# Altium project RS2-708_V010.PrjPCB (part 5 of 6)
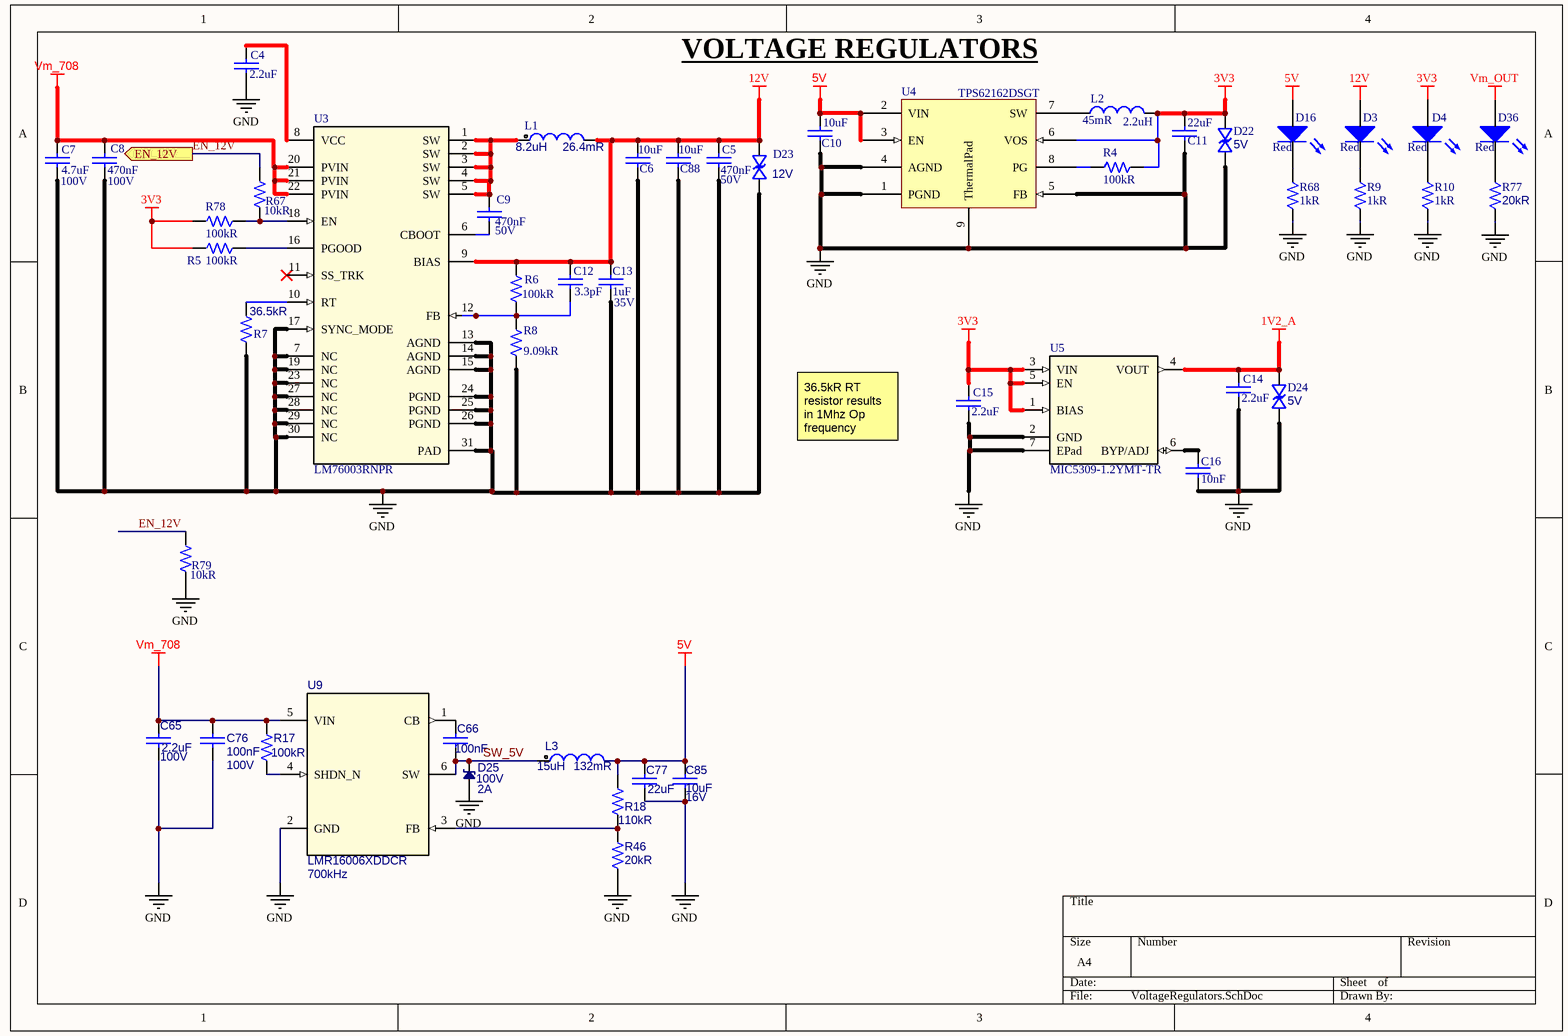
[diagram p11: VoltageRegulators.SchDoc]

## Sheet VoltageRegulators.SchDoc (continued)

### Library data of the parts (continued)
R67 R79 = Resistor: as R19 on sheet KSZ8795CLX; Supplier 1: Digi-Key; Supplier Part Number 1: P10.0KLDKR-ND; Stock 1: 3290329; Pricing 1: 1=0,10000, 10=0,04100, 100=0,01680, 1000=0,00753, 2500=0,00653, 5000=0,00540 (USD); RoHS: Yes; Mount: Surface Mount; Case/Package: 0402; Number of Pins: 2; Contact Plating: Tin; Case Code (Metric): 1005; Case Code (Imperial): 0402; Min Operating Temperature: -55°C; Max Operating Temperature: 155°C; Packaging: Tape and Reel; Package Quantity: 1; Voltage Rating (DC): 50V; Features: Automotive AEC-Q200; Max Power Dissipation: 100mW; Composition: Thick Film; Number of Terminations: 2; Termination: SMD/SMT; Military Standard: Not; Length: 1mm; Height: 0.35mm; Width: 0.02inch; Depth: 0.5mm; Radiation Hardening: No; Lead Free: Lead Free; REACH SVHC: No SVHC; ComponentLink1URL: https://datasheet.ciiva.com/11821/0900766b80f80784-11821171.pdf?src-supplier=RSComponents; ComponentLink1Description: https://datasheet.ciiva.com/11821/0900766b80f80784-11821171.pdf?src-supplier=RSComponents; ComponentLink2URL: https://datasheet.ciiva.com/16199/aoa0000ce2-16199478.pdf?src-supplier=Future+Electronics; ComponentLink2Description: https://datasheet.ciiva.com/16199/aoa0000ce2-16199478.pdf?src-supplier=Future+Electronics; ComponentLink3URL: https://datasheet.ciiva.com/17212/aoa0000ce2-17212102.pdf?src-supplier=Avnet+Europe; ComponentLink3Description: https://datasheet.ciiva.com/17212/aoa0000ce2-17212102.pdf?src-supplier=Avnet+Europe; ComponentLink4URL: https://datasheet.ciiva.com/24023/aoa0000ce2-24023017.pdf?src-supplier=Mouser; ComponentLink4Description: https://datasheet.ciiva.com/24023/aoa0000ce2-24023017.pdf?src-supplier=Mouser; ComponentLink5URL: https://datasheet.ciiva.com/28514/1678782-28514185.pdf?src-supplier=Element14; ComponentLink5Description: https://datasheet.ciiva.com/28514/1678782-28514185.pdf?src-supplier=Element14; ComponentLink6URL: https://datasheet.ciiva.com/43467/1678782-43467402.pdf?src-supplier=Farnell; ComponentLink6Description: https://datasheet.ciiva.com/43467/1678782-43467402.pdf?src-supplier=Farnell; ComponentLink7URL: https://datasheet.ciiva.com/27055/1987020-27055643.pdf?src-supplier=Jameco; ComponentLink7Description: https://datasheet.ciiva.com/27055/1987020-27055643.pdf?src-supplier=Jameco; ComponentLink8URL: https://datasheet.ciiva.com/48531/aoa0000ce2-48531069.pdf?src-supplier=Avnet; ComponentLink8Description: https://datasheet.ciiva.com/48531/aoa0000ce2-48531069.pdf?src-supplier=Avnet; ComponentLink9URL: https://datasheet.ciiva.com/9194/aoa0000ce2-9194142.pdf?src-supplier=Avnet; ComponentLink9Description: https://datasheet.ciiva.com/9194/aoa0000ce2-9194142.pdf?src-supplier=Avnet; ComponentLink10URL: https://datasheet.ciiva.com/16782/70260748-16782590.pdf?src-supplier=Allied+Electronics; ComponentLink10Description: https://datasheet.ciiva.com/16782/70260748-16782590.pdf?src-supplier=Allied+Electronics; ComponentLink11URL: https://datasheet.ciiva.com/16786/70260748-16786734.pdf?src-supplier=Allied+Electronics; ComponentLink11Description: https://datasheet.ciiva.com/16786/70260748-16786734.pdf?src-supplier=Allied+Electronics; ComponentLink12URL: https://datasheet.ciiva.com/30201/aoa0000ce2-30201022.pdf?src-supplier=Onlinecomponents.com; ComponentLink12Description: https://datasheet.ciiva.com/30201/aoa0000ce2-30201022.pdf?src-supplier=Onlinecomponents.com
R77 = Resistor: RES SMD 20K OHM 5% 1/4W 0603; Manufacturer 1: Panasonic; Manufacturer Part Number 1: ERJ-PA3J203V; Max Power Dissipation: 250mW; Temperature Coefficient: 200ppm/°C; Supplier 1: Digi-Key; Supplier Part Number 1: P20KBZCT-ND; RoHS: Yes; Category: Chip SMD Resistors; Stock 1: 22079; Pricing 1: 1=0,10000, 10=0,08600, 100=0,03300, 1000=0,01452, 2500=0,01254 (USD); Case/Package: 0603; Case Code (Imperial): 0603; Case Code (Metric): 1608; Min Operating Temperature: -55°C; Max Operating Temperature: 155°C; Tolerance: 5%; Packaging: Tape and Reel; Resistor Type: Thick Film; Number of Terminations: 2; Features: Automotive AEC-Q200; Length: 0.063inch; Width: 0.031inch; Height: 0.018inch; ComponentLink1URL: https://industrial.panasonic.com/cdbs/www-data/pdf/RDO0000/AOA0000C331.pdf?src-supplier=Digi-Key; ComponentLink1Description: https://industrial.panasonic.com/cdbs/www-data/pdf/RDO0000/AOA0000C331.pdf?src-supplier=Digi-Key
U3 = LM76003RNPR: Buck Switching Regulator IC Positive Adjustable 1V 1 Output 3.5A 30-WFQFN Exposed Pad; Manufacturer 1: Texas Instruments; Number of Outputs: 1; Min Input Voltage: 3.5V; Max Input Voltage: 60V; Max Output Voltage: 57V; Switching Frequency: 2.2MHz; Synchronous Rectifier: Yes; Supplier 1: Digi-Key; Manufacturer Part Number 1: LM76003RNPR; Stock 1: 8327; Pricing 1: 1=6,06000, 10=5,44500, 25=5,14800, 100=4,23280, 250=3,79808, 500=3,66080, 1000=3,04304 (USD); RoHS: No; Mount: Surface Mount; Min Operating Temperature: -40°C; Max Operating Temperature: 125°C; Output Type: Adjustable; Packaging: Tape and Reel; Output Configuration: Positive; Min Output Voltage: 1V; Output Current: 3.5A; ComponentLink1URL: http://www.ti.com/lit/ds/symlink/lm76003.pdf?src-supplier=Digi-Key; ComponentLink1Description: http://www.ti.com/lit/ds/symlink/lm76003.pdf?src-supplier=Digi-Key; Supplier Part Number 1: 296-49740-1-ND
U4 = TPS6216X: Manufacturer 1: Texas Instruments; Min Output Voltage: 3.3V; Synchronous Rectifier: Yes; Max Output Current: 1A; Max Input Voltage: 17V; Min Input Voltage: 3V; Output Type: Fixed; Output Configuration: Positive; Quiescent Current: 17uA; Switching Frequency: 2.25MHz; Number of Outputs: 1; Supplier 1: Digi-Key; Supplier Part Number 1: 296-29897-1-ND; Stock 1: 23948; Pricing 1: 1=1,63000, 10=1,46000, 25=1,38600, 100=1,06430 (USD); RoHS: Yes; Case/Package: SOIC; Number of Pins: 8; Contact Plating: Gold; Min Operating Temperature: -40°C; Max Operating Temperature: 125°C; Max Output Voltage: 3.3V; Output Voltage: 3.3V; Output Current: 1A; Packaging: Tape and Reel; Package Quantity: 1; Nominal Output Voltage: 3.3V; Operating Supply Voltage: 17V; Length: 2.1mm; Height: 0.75mm; Width: 2.1mm; Radiation Hardening: No; REACH SVHC: No SVHC; Lead Free: Lead Free; ComponentLink1URL: https://datasheet.ciiva.com/2026/tps62160-2026052.pdf?src-supplier=Digi-Key; ComponentLink1Description: https://datasheet.ciiva.com/2026/tps62160-2026052.pdf?src-supplier=Digi-Key; ComponentLink2URL: https://datasheet.ciiva.com/2026/tps62160-2026053.pdf?src-supplier=Digi-Key; ComponentLink2Description: https://datasheet.ciiva.com/2026/tps62160-2026053.pdf?src-supplier=Digi-Key; ComponentLink3URL: https://datasheet.ciiva.com/2026/tps62160-2026054.pdf?src-supplier=Digi-Key; ComponentLink3Description: https://datasheet.ciiva.com/2026/tps62160-2026054.pdf?src-supplier=Digi-Key; ComponentLink4URL: https://datasheet.ciiva.com/46425/1857528-46425721.pdf?src-supplier=Element14; ComponentLink4Description: https://datasheet.ciiva.com/46425/1857528-46425721.pdf?src-supplier=Element14; ComponentLink5URL: https://datasheet.ciiva.com/46425/1857528-46425722.pdf?src-supplier=Element14; ComponentLink5Description: https://datasheet.ciiva.com/46425/1857528-46425722.pdf?src-supplier=Element14; ComponentLink6URL: https://datasheet.ciiva.com/46425/1857528-46425743.pdf?src-supplier=Element14; ComponentLink6Description: https://datasheet.ciiva.com/46425/1857528-46425743.pdf?src-supplier=Element14
U5 = MIC5309-xx: Linear Voltage Regulator; Manufacturer 1: Microchip; Supplier 1: Digi-Key; Supplier Part Number 1: 576-3050-1-ND; Stock 1: 5043; Pricing 1: 1=0,81000, 25=0,67000, 100=0,61000 (USD); RoHS: Yes; ComponentLink1URL: https://datasheet.ciiva.com/46425/1833743-46425628.pdf?src-supplier=Element14; ComponentLink1Description: https://datasheet.ciiva.com/46425/1833743-46425628.pdf?src-supplier=Element14
U9 = LMR16006: SIMPLE SWITCHER® 4V to 60V, 600mA Step-Down Regulator with Low Iq 6-SOT-23-THIN -40 to 125; Manufacturer 1: Texas Instruments; Number of Outputs: 1; Output Voltage: 55V; Min Output Voltage: 765mV; Synchronous Rectifier: No; Quiescent Current: 28uA; Output Type: Adjustable; Output Configuration: Positive; Supplier 1: Digi-Key; Supplier Part Number 1: 296-40293-1-ND; RoHS: Yes; Category: Power Supply Modules; Pricing 1: 1=3,26000, 10=2,93100, 25=2,77120, 100=2,40190, 250=2,27868, 500=2,04466, 1000=2,03350 (USD); Mount: Surface Mount; Case/Package: SOT-23-6; Number of Pins: 6; Contact Plating: Gold; Min Operating Temperature: -40°C; Max Operating Temperature: 125°C; Max Output Current: 600mA; Min Input Voltage: 4V; Max Input Voltage: 60V; Packaging: Tape and Reel; Max Output Voltage: 55V; Output Current: 600mA; Operating Supply Voltage: 60V; REACH SVHC: No SVHC; Lead Free: Lead Free; RoHS Compliant: Yes; ComponentLink1URL: http://www.ti.com/general/docs/lit/getliterature.tsp?genericPartNumber=LMR16006&&fileType=pdf&src-supplier=Avnet; ComponentLink1Description: http://www.ti.com/general/docs/lit/getliterature.tsp?genericPartNumber=LMR16006&&fileType=pdf&src-supplier=Avnet; ComponentLink2URL: http://www.ti.com/lit/ds/symlink/lmr16006.pdf?src-supplier=Digi-Key; ComponentLink2Description: http://www.ti.com/lit/ds/symlink/lmr16006.pdf?src-supplier=Digi-Key; ComponentLink3URL: http://www.ti.com/general/docs/lit/getliterature.tsp?genericPartNumber=LMR16006&amp;&amp;fileType=pdf&src-supplier=Farnell; ComponentLink3Description: http://www.ti.com/general/docs/lit/getliterature.tsp?genericPartNumber=LMR16006&amp;&amp;fileType=pdf&src-supplier=Farnell; ComponentLink4URL: http://www.ti.com/general/docs/lit/getliterature.tsp?genericPartNumber=LMR16006&&fileType=pdf&src-supplier=Element14; ComponentLink4Description: http://www.ti.com/general/docs/lit/getliterature.tsp?genericPartNumber=LMR16006&&fileType=pdf&src-supplier=Element14; ComponentLink5URL: http://www.ti.com/general/docs/lit/getliterature.tsp?genericPartNumber=LMR16006&amp;&amp;fileType=pdf&src-supplier=Avnet+Asia; ComponentLink5Description: http://www.ti.com/general/docs/lit/getliterature.tsp?genericPartNumber=LMR16006&amp;&amp;fileType=pdf&src-supplier=Avnet+Asia

## Sheet W5500_ETH-SPI.SchDoc
size A4
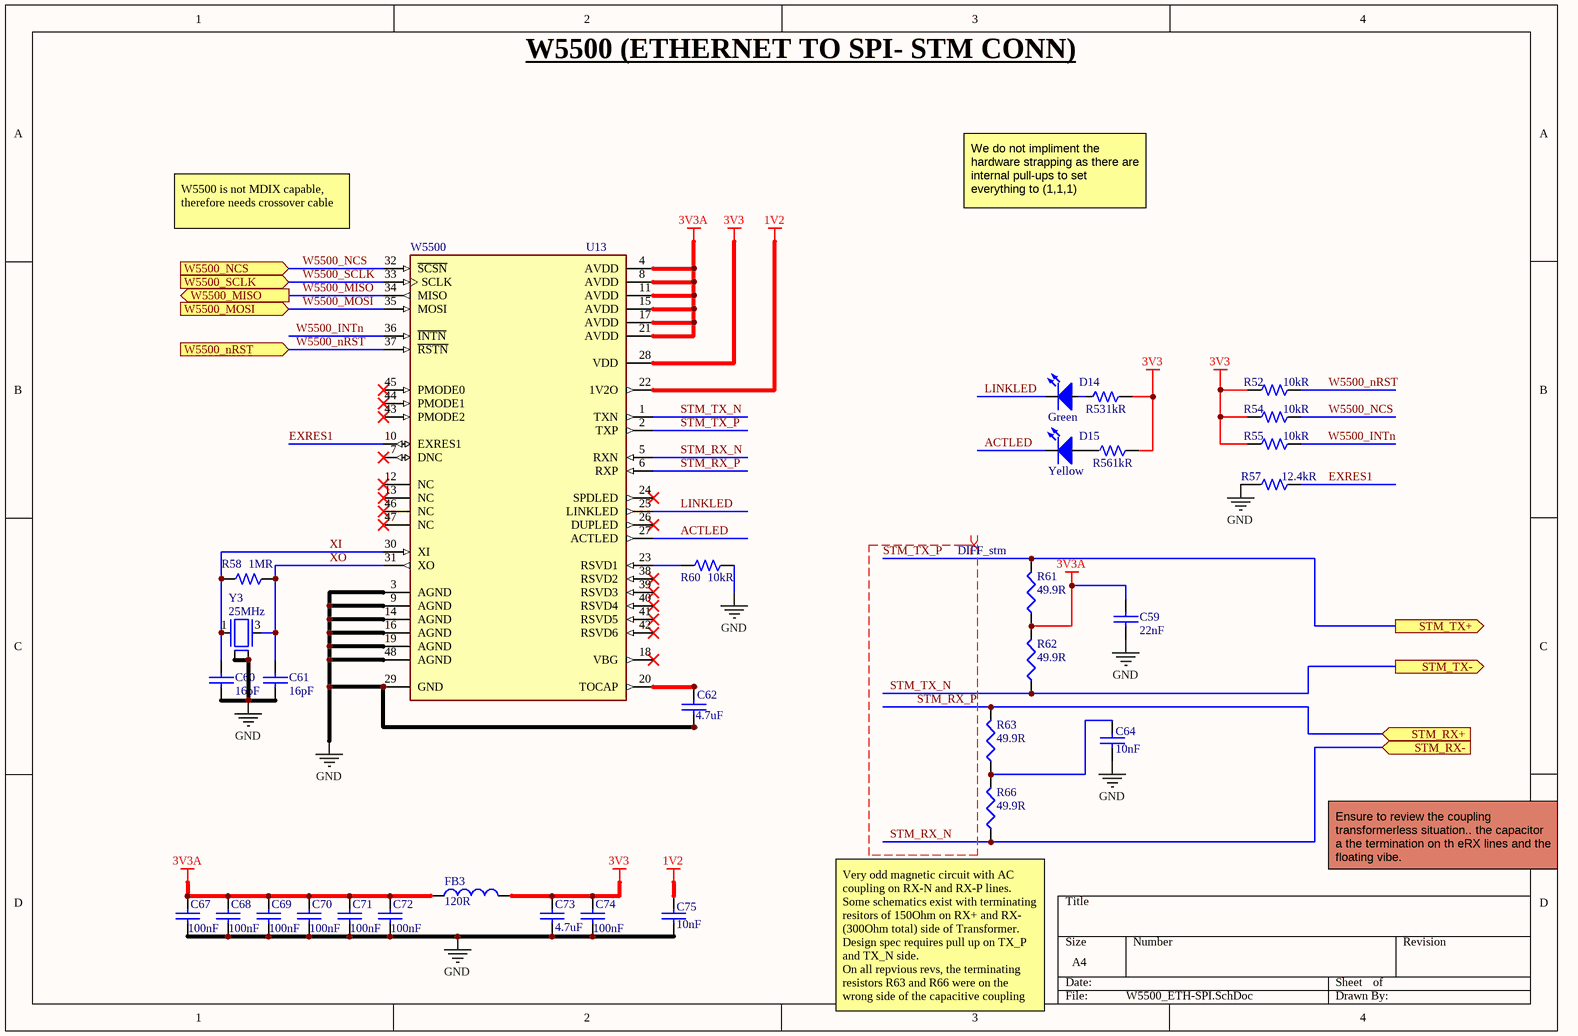
[diagram p7: W5500_ETH-SPI.SchDoc]

### Parts
C59  Capacitance: 22nF  [CAP0402]  (hidden comment: Capacitor)
C60  Capacitance: 16pF  [CAP0402]  (hidden comment: Capacitor)
C61  Capacitance: 16pF  [CAP0402]  (hidden comment: Capacitor)
C62  Capacitance: 4.7uF  [CAP0402]  (hidden comment: Capacitor)
C64  Capacitance: 10nF  [CAP0402]  (hidden comment: Capacitor)
C67  Capacitance: 100nF  [CAP0402]  (hidden comment: Capacitor)
C68  Capacitance: 100nF  [CAP0402]  (hidden comment: Capacitor)
C69  Capacitance: 100nF  [CAP0402]  (hidden comment: Capacitor)
C70  Capacitance: 100nF  [CAP0402]  (hidden comment: Capacitor)
C71  Capacitance: 100nF  [CAP0402]  (hidden comment: Capacitor)
C72  Capacitance: 100nF  [CAP0402]  (hidden comment: Capacitor)
C73  Capacitance: 4.7uF  [CAP0402]  (hidden comment: Capacitor)
C74  Capacitance: 100nF  [CAP0402]  (hidden comment: Capacitor)
C75  Capacitance: 10nF  [CAP0402]  (hidden comment: Capacitor)
D14  Color: Green  [LED-0603-GREEN]  (hidden comment: LED)
D15  Color: Yellow  [LED-0603-YELLOW]  (hidden comment: LED)
FB3  Impedance: 120R  [RES0402]  (hidden comment: Ferrite Bead)
R52  Resistance: 10kR  [RES0402]  (hidden comment: Resistor)
R53  Resistance: 1kR  [RES0402]  (hidden comment: Resistor)
R54  Resistance: 10kR  [RES0402]  (hidden comment: Resistor)
R55  Resistance: 10kR  [RES0402]  (hidden comment: Resistor)
R56  Resistance: 1kR  [RES0402]  (hidden comment: Resistor)
R57  Resistance: 12.4kR  [RES0402]  (hidden comment: Resistor)
R58  Resistance: 1MR  [RES0402]  (hidden comment: Resistor)
R60  Resistance: 10kR  [RES0402]  (hidden comment: Resistor)
R61  Resistance: 49.9R  [RES0402]  (hidden comment: Res)
R62  Resistance: 49.9R  [RES0402]  (hidden comment: Res)
R63  Resistance: 49.9R  [RES0402]  (hidden comment: Res)
R66  Resistance: 49.9R  [RES0402]  (hidden comment: Res)
U13  Manufacturer Part Number 1: W5500  [LQFP-48, 7x7mm, 0.5mm pitch]  (hidden comment: W5500_LQFP48)
Y3  Frequency: 25MHz  [CRYSTAL_ABM8G]  (hidden comment: Crystal_4Pin_ABM8G)

### Ports
STM_RX+ (in), STM_RX- (in), STM_TX+ (out), STM_TX- (out), W5500_MISO (out), W5500_MOSI (in), W5500_NCS (in), W5500_nRST (in), W5500_SCLK (in)

### Nets
1V2: C75.1 U13.22(1V2O)
3V3: C73.1 C74.1 FB3.2 R52.2 R53.2 R54.2 R55.2 R56.2 U13.28(VDD)
3V3A: C59.1 C67.1 C68.1 C69.1 C70.1 C71.1 C72.1 FB3.1 R61.1 R62.2 U13.4(AVDD) U13.8(AVDD) U13.11(AVDD) U13.15(AVDD) U13.17(AVDD) U13.21(AVDD)
GND: C59.2 C60.1 C61.1 C62.2 C64.2 C67.2 C68.2 C69.2 C70.2 C71.2 C72.2 C73.2 C74.2 C75.2 R57.2 R60.1 U13.3(AGND) U13.9(AGND) U13.14(AGND) U13.16(AGND) U13.19(AGND) U13.29(GND) U13.48(AGND) Y3.2(GND) Y3.4(GND)
ACTLED: D15.1 U13.27(ACTLED)
EXRES1: R57.1 U13.10(EXRES1)
LINKLED: D14.1 U13.25(LINKLED)
STM_RX_N: R66.1 U13.5(RXN) ; port STM_RX-  [project net B_TX-]
STM_RX_P: R63.2 U13.6(RXP) ; port STM_RX+  [project net B_TX+]
STM_TX_N: R62.1 U13.1(TXN) ; port STM_TX-  [project net B_RX-]
STM_TX_P: R61.2 U13.2(TXP) ; port STM_TX+  [project net B_RX+]
W5500_INTn: R55.1 U13.36(~{INTN})
W5500_MISO: U13.34(MISO) ; port W5500_MISO
W5500_MOSI: U13.35(MOSI) ; port W5500_MOSI
W5500_NCS: R54.1 U13.32(~{SCSN}) ; port W5500_NCS
W5500_nRST: R52.1 U13.37(~{RSTN}) ; port W5500_nRST
W5500_SCLK: U13.33(SCLK) ; port W5500_SCLK
XI: C60.2 R58.1 U13.30(XI) Y3.1(Osc1)
XO: C61.2 R58.2 U13.31(XO) Y3.3(Osc2)
NetC62_1: C62.1 U13.20(TOCAP)
NetC64_1: C64.1 R63.1 R66.2
NetD14_2: D14.2 R53.1
NetD15_2: D15.2 R56.1
NetR60_2: R60.2 U13.23(RSVD1)

Not connected (* = marked no-connect by the designer): U13 7(DNC)* 12(NC)* 13(NC)* 18(VBG)* 24(SPDLED)* 26(DUPLED)* 38(RSVD2)* 39(RSVD3)* 40(RSVD4)* 41(RSVD5)* 42(RSVD6)* 43(PMODE2)* 44(PMODE1)* 45(PMODE0)* 46(NC)* 47(NC)*

### Layout directives
differential pair; differential pair class DIFF_stm; rule Differential Pairs Routing [Pref Gap = 0.2mm    Min Gap  = 0.15mm    Max Gap  = 0.25mmPref Width = 0.2mm    Min Width  = 0.15mm    Max Width  = 0.2mm]: STM_RX_N, STM_RX_P, STM_TX_N, STM_TX_P

### Notes on the sheet
- W5500 (ETHERNET TO SPI- STM CONN)
- W5500 is not MDIX capable, therefore needs crossover cable
- We do not impliment the hardware strapping as there are internal pull-ups to set everything to (1,1,1)
- Ensure to review the coupling transformerless situation.. the capacitor a the termination on th eRX lines and the floating vibe.
- (near R66) Very odd magnetic circuit with AC coupling on RX-N and RX-P lines. Some schematics exist with terminating resitors of 150Ohm on RX+ and RX- (300Ohm total) side of Transformer. Design spec requires pull up on TX_P and TX_N side.
  On all repvious revs, the terminating resistors R63 and R66 were on the wrong side of the capacitive coupling

### Library data of the parts
C59 = Capacitor: Manufacturer 1: Murata; Manufacturer Part Number 1: GCM155R71H223KA55D; Voltage Rating: 50V; Dielectric: X7R; Manufacturer: *; Manufacturer Part Number: *; Supplier: *; Supplier Part Number: *; Tolerance: *; Voltage: *; Footprint: *; Temperature Coefficient: *; Supplier 1: Digi-Key; Supplier Part Number 1: 490-4763-1-ND; Stock 1: 1693651; Pricing 1: 1=0,11000, 10=0,07700, 100=0,03450, 500=0,02462, 1000=0,01935, 2500=0,01759, 5000=0,01618 (USD); RoHS: Yes; Mount: Surface Mount; Case/Package: 0402; Case Code (Metric): 1005; Case Code (Imperial): 0402; Min Operating Temperature: -55°C; Max Operating Temperature: 125°C; Packaging: Tape and Reel; Package Quantity: 10000; Voltage Rating (DC): 50V; Termination: SMD/SMT; Length: 1mm; Height: 0.5mm; Width: 0.02inch; Thickness: 0.022inch; Depth: 0.5mm; Ratings: AEC-Q200; Radiation Hardening: No; Lead Free: Lead Free; ComponentLink1URL: https://datasheet.ciiva.com/155/product-155891.pdf?src-supplier=Digi-Key; ComponentLink1Description: https://datasheet.ciiva.com/155/product-155891.pdf?src-supplier=Digi-Key; ComponentLink2URL: https://datasheet.ciiva.com/155/product-155890.pdf?src-supplier=Digi-Key; ComponentLink2Description: https://datasheet.ciiva.com/155/product-155890.pdf?src-supplier=Digi-Key; ComponentLink3URL: https://datasheet.ciiva.com/16199/product-16199333.pdf?src-supplier=Future+Electronics; ComponentLink3Description: https://datasheet.ciiva.com/16199/product-16199333.pdf?src-supplier=Future+Electronics; ComponentLink4URL: https://datasheet.ciiva.com/155/product-155892.pdf?src-supplier=Digi-Key; ComponentLink4Description: https://datasheet.ciiva.com/155/product-155892.pdf?src-supplier=Digi-Key; ComponentLink5URL: https://datasheet.ciiva.com/16624/product-16624552.pdf?src-supplier=Avnet+Europe; ComponentLink5Description: https://datasheet.ciiva.com/16624/product-16624552.pdf?src-supplier=Avnet+Europe
C60 C61 = Capacitor: Manufacturer 1: Murata; Manufacturer Part Number 1: GRM1555C1H160JA01D; Material: Ceramic; Voltage Rating: 50V; Dielectric: C0G; Manufacturer: *; Manufacturer Part Number: *; Supplier: *; Supplier Part Number: *; Tolerance: *; Voltage: *; Footprint: *; Temperature Coefficient: *; Supplier 1: Digi-Key; Supplier Part Number 1: 490-5926-1-ND; Stock 1: 244001; Pricing 1: 1=0,10000, 10=0,06500, 100=0,02920, 500=0,02082, 1000=0,01637, 2500=0,01488, 5000=0,01369 (USD); RoHS: Yes; Mount: Surface Mount; Case/Package: 0402; Case Code (Metric): 1005; Case Code (Imperial): 0402; Min Operating Temperature: -55°C; Max Operating Temperature: 125°C; Packaging: Tape and Reel; Package Quantity: 1; Voltage Rating (DC): 50V; Termination: SMD/SMT; Length: 1mm; Height: 0.5mm; Width: 0.5mm; Thickness: 0.022inch; Depth: 0.5mm; Radiation Hardening: No; REACH SVHC: No SVHC; Lead Free: Lead Free; ComponentLink1URL: https://datasheet.ciiva.com/3778/10932grm1555c1h160ja0123-3778199.pdf?src-supplier=Arrow; ComponentLink1Description: https://datasheet.ciiva.com/3778/10932grm1555c1h160ja0123-3778199.pdf?src-supplier=Arrow; ComponentLink2URL: https://datasheet.ciiva.com/6256/grm1555c1h160ja01-01-6256808.pdf?src-supplier=Digi-Key; ComponentLink2Description: https://datasheet.ciiva.com/6256/grm1555c1h160ja01-01-6256808.pdf?src-supplier=Digi-Key; ComponentLink3URL: https://datasheet.ciiva.com/18184/getdatasheetpartid-319096-18184204.pdf?src-supplier=Verical; ComponentLink3Description: https://datasheet.ciiva.com/18184/getdatasheetpartid-319096-18184204.pdf?src-supplier=Verical; ComponentLink4URL: https://datasheet.ciiva.com/22698/1666664-22698393.pdf?src-supplier=Element14; ComponentLink4Description: https://datasheet.ciiva.com/22698/1666664-22698393.pdf?src-supplier=Element14; ComponentLink5URL: https://datasheet.ciiva.com/6256/partnumbering-e-01-6256810.pdf?src-supplier=Digi-Key; ComponentLink5Description: https://datasheet.ciiva.com/6256/partnumbering-e-01-6256810.pdf?src-supplier=Digi-Key; ComponentLink6URL: https://datasheet.ciiva.com/6256/partnumbering-e-01-6256812.pdf?src-supplier=Digi-Key; ComponentLink6Description: https://datasheet.ciiva.com/6256/partnumbering-e-01-6256812.pdf?src-supplier=Digi-Key; ComponentLink7URL: https://datasheet.ciiva.com/5426/product-5426941.pdf?src-supplier=Mouser; ComponentLink7Description: https://datasheet.ciiva.com/5426/product-5426941.pdf?src-supplier=Mouser
C62 C73 = Capacitor: Manufacturer 1: Samsung; Manufacturer Part Number 1: CL05A475MO5NUNC; Voltage Rating: 16V; Manufacturer: *; Manufacturer Part Number: *; Supplier: *; Supplier Part Number: *; Tolerance: *; Voltage: *; Footprint: *; Temperature Coefficient: *; Supplier 1: Digi-Key; Supplier Part Number 1: 1276-6836-1-ND; Stock 1: 2288634; Pricing 1: 1=0,41000, 10=0,29200, 100=0,19210, 500=0,14232, 1000=0,12097, 2500=0,11386, 5000=0,10674 (USD); RoHS: Yes; Mount: Surface Mount; Case/Package: 0402; Case Code (Metric): 1005; Case Code (Imperial): 0402; Min Operating Temperature: -55°C; Max Operating Temperature: 85°C; Packaging: Tape and Reel; Length: 0.039inch; Width: 0.02inch; Thickness: 0.022inch; ComponentLink1URL: http://www.samsungsem.com/kr/support/product-search/mlcc/CL05A475MO5NUNC.jsp?src-supplier=Digi-Key; ComponentLink1Description: http://www.samsungsem.com/kr/support/product-search/mlcc/CL05A475MO5NUNC.jsp?src-supplier=Digi-Key
C64 C75 = Capacitor: Manufacturer 1: Murata; Manufacturer Part Number 1: GCM155R71H103KA55D; Voltage Rating: 50V; Dielectric: X7R; Manufacturer: *; Manufacturer Part Number: *; Supplier: *; Supplier Part Number: *; Tolerance: *; Voltage: *; Footprint: *; Temperature Coefficient: *; Supplier 1: Digi-Key; Supplier Part Number 1: 490-4762-1-ND; Stock 1: 20325180; Pricing 1: 1=0,10000, 10=0,04400, 100=0,01980, 500=0,01412, 1000=0,01109, 2500=0,01008, 5000=0,00927 (USD); RoHS: Yes; Mount: Surface Mount; Case/Package: 0402; Case Code (Imperial): 0402; Case Code (Metric): 1005; Min Operating Temperature: -55°C; Max Operating Temperature: 125°C; Packaging: Tape and Reel; Package Quantity: 1; Termination: SMD/SMT; Voltage Rating (DC): 50V; Length: 1mm; Height: 0.5mm; Width: 0.02inch; Thickness: 0.022inch; Depth: 0.5mm; Ratings: AEC-Q200; Radiation Hardening: No; REACH SVHC: No SVHC; Lead Free: Lead Free; ComponentLink1URL: https://datasheet.ciiva.com/16199/product-16199584.pdf?src-supplier=Future+Electronics; ComponentLink1Description: https://datasheet.ciiva.com/16199/product-16199584.pdf?src-supplier=Future+Electronics; ComponentLink2URL: https://datasheet.ciiva.com/18100/getdatasheetpartid-27433-18100656.pdf?src-supplier=Verical; ComponentLink2Description: https://datasheet.ciiva.com/18100/getdatasheetpartid-27433-18100656.pdf?src-supplier=Verical; ComponentLink3URL: https://datasheet.ciiva.com/11787/0900766b80ef92d0-11787082.pdf?src-supplier=RSComponents; ComponentLink3Description: https://datasheet.ciiva.com/11787/0900766b80ef92d0-11787082.pdf?src-supplier=RSComponents; ComponentLink4URL: https://datasheet.ciiva.com/130/product-130683.pdf?src-supplier=Digi-Key; ComponentLink4Description: https://datasheet.ciiva.com/130/product-130683.pdf?src-supplier=Digi-Key; ComponentLink5URL: https://datasheet.ciiva.com/130/product-130682.pdf?src-supplier=Digi-Key; ComponentLink5Description: https://datasheet.ciiva.com/130/product-130682.pdf?src-supplier=Digi-Key; ComponentLink6URL: https://datasheet.ciiva.com/130/product-130684.pdf?src-supplier=Digi-Key; ComponentLink6Description: https://datasheet.ciiva.com/130/product-130684.pdf?src-supplier=Digi-Key; ComponentLink7URL: https://datasheet.ciiva.com/2989/product-2989235.pdf?src-supplier=Avnet; ComponentLink7Description: https://datasheet.ciiva.com/2989/product-2989235.pdf?src-supplier=Avnet; ComponentLink8URL: https://datasheet.ciiva.com/16624/product-16624550.pdf?src-supplier=Avnet+Europe; ComponentLink8Description: https://datasheet.ciiva.com/16624/product-16624550.pdf?src-supplier=Avnet+Europe
C67-C72 C74 = Capacitor: Manufacturer: TDK; Manufacturer Part Number: CGA2B3X7R1H104K050BB; Voltage Rating: 50V; Tolerance: 10%; Dielectric: X7R; Supplier 1: Digi-Key; Supplier Part Number 1: 445-6899-1-ND; Stock 1: 14098587; Mount: Surface Mount; Case/Package: 0402; Weight: 2.3E-05oz; Case Code (Metric): 1005; Case Code (Imperial): 0402; Min Operating Temperature: -55°C; Max Operating Temperature: 125°C; Packaging: Tape and Reel; Package Quantity: 1; Voltage Rating (DC): 50V; Termination: SMD/SMT; Composition: Ceramic; Voltage: 50V; Length: 1mm; Height: 0.5mm; Width: 0.02inch; Thickness: 0.022inch; Depth: 0.5mm; Ratings: AEC-Q200; REACH SVHC: No SVHC; Lead Free: Lead Free; ComponentLink1URL: http://product.tdk.com/capacitor/mlcc/en/documents/mlccspec_automotive_general_midvoltage_en.pdf?src-supplier=Future+Electronics; ComponentLink1Description: http://product.tdk.com/capacitor/mlcc/en/documents/mlccspec_automotive_general_midvoltage_en.pdf?src-supplier=Future+Electronics; ComponentLink2URL: http://www.farnell.com/datasheets/1807242.pdf?src-supplier=Element14; ComponentLink2Description: http://www.farnell.com/datasheets/1807242.pdf?src-supplier=Element14; ComponentLink3URL: http://www.mouser.com/ds/2/400/lcc_automotive_general_en-843974.pdf?src-supplier=Mouser; ComponentLink3Description: http://www.mouser.com/ds/2/400/lcc_automotive_general_en-843974.pdf?src-supplier=Mouser; ComponentLink4URL: http://www.farnell.com/datasheets/1936565.pdf?src-supplier=Element14; ComponentLink4Description: http://www.farnell.com/datasheets/1936565.pdf?src-supplier=Element14; ComponentLink5URL: http://www.farnell.com/datasheets/1735392.pdf?src-supplier=Element14; ComponentLink5Description: http://www.farnell.com/datasheets/1735392.pdf?src-supplier=Element14
D14 = LED: Manufacturer 1: Wurth Electronics; Manufacturer Part Number 1: 150060GS75000; Dominant Wavelength: 520nm; Test Current: 20mA; Viewing Angle: 140°; Lens Style: Clear,Rectangular; Luminous Intensity: 430mcd; Forward Current: 30mA; Forward Voltage: 3.2V; Colour: *; Supplier 1: Digi-Key; Supplier Part Number 1: 732-4971-1-ND; Stock 1: 151234; Pricing 1: 1=0,14000, 50=0,13300, 100=0,11400, 500=0,09900 (USD); RoHS: Yes; Mount: Surface Mount; Case/Package: 0603; Case Code (Imperial): 0603; Case Code (Metric): 1608; Min Operating Temperature: -40°C; Max Operating Temperature: 85°C; Wavelength: 520nm; Package Quantity: 4000; Packaging: Tape and Reel; Length: 1.6mm; Height: 0.7mm; Width: 0.8mm; REACH SVHC: Unknown; Lead Free: Lead Free; ComponentLink1URL: https://datasheet.ciiva.com/29562/150060gs75000-29562868.pdf?src-supplier=Digi-Key; ComponentLink1Description: https://datasheet.ciiva.com/29562/150060gs75000-29562868.pdf?src-supplier=Digi-Key; ComponentLink2URL: https://datasheet.ciiva.com/29279/759427-da-01-en-chipled-0603-w-kl-gruen-150060gs75000-29279201.pdf?src-supplier=Conrad; ComponentLink2Description: https://datasheet.ciiva.com/29279/759427-da-01-en-chipled-0603-w-kl-gruen-150060gs75000-29279201.pdf?src-supplier=Conrad; ComponentLink3URL: https://datasheet.ciiva.com/29562/150060gs75000-29562869.pdf?src-supplier=Digi-Key; ComponentLink3Description: https://datasheet.ciiva.com/29562/150060gs75000-29562869.pdf?src-supplier=Digi-Key; ComponentLink4URL: https://datasheet.ciiva.com/29562/150060gs75000-29562870.pdf?src-supplier=Digi-Key; ComponentLink4Description: https://datasheet.ciiva.com/29562/150060gs75000-29562870.pdf?src-supplier=Digi-Key
D15 = LED: Manufacturer 1: Wurth Electronics; Manufacturer Part Number 1: 150060YS75000; Dominant Wavelength: 590nm; Test Current: 20mA; Viewing Angle: 140°; Lens Style: Clear,Rectangular; Luminous Intensity: 120mcd; Forward Voltage: 2V; Forward Current: 30mA; Colour: *; Supplier 1: Digi-Key; Supplier Part Number 1: 732-4981-1-ND; Stock 1: 48758; Pricing 1: 1=0,14000, 50=0,13300, 100=0,11400, 500=0,09900 (USD); RoHS: Yes; Mount: Surface Mount; Case/Package: 0603; Case Code (Imperial): 0603; Case Code (Metric): 1608; Min Operating Temperature: -40°C; Max Operating Temperature: 85°C; Package Quantity: 4000; Packaging: Tape and Reel; Wavelength: 590nm; Length: 1.6mm; Height: 0.7mm; Width: 0.8mm; REACH SVHC: Unknown; ComponentLink1URL: https://datasheet.ciiva.com/23843/150060ys75000-23843250.pdf?src-supplier=Newark; ComponentLink1Description: https://datasheet.ciiva.com/23843/150060ys75000-23843250.pdf?src-supplier=Newark; ComponentLink2URL: https://datasheet.ciiva.com/29279/759432-da-01-en-chipled-0603-w-kl-gelb-150060ys75000-29279206.pdf?src-supplier=Conrad; ComponentLink2Description: https://datasheet.ciiva.com/29279/759432-da-01-en-chipled-0603-w-kl-gelb-150060ys75000-29279206.pdf?src-supplier=Conrad; ComponentLink3URL: https://datasheet.ciiva.com/29563/150060ys75000-29563045.pdf?src-supplier=Digi-Key; ComponentLink3Description: https://datasheet.ciiva.com/29563/150060ys75000-29563045.pdf?src-supplier=Digi-Key; ComponentLink4URL: https://datasheet.ciiva.com/22656/1911348-22656951.pdf?src-supplier=Element14; ComponentLink4Description: https://datasheet.ciiva.com/22656/1911348-22656951.pdf?src-supplier=Element14; ComponentLink5URL: https://datasheet.ciiva.com/29563/150060ys75000-29563033.pdf?src-supplier=Digi-Key; ComponentLink5Description: https://datasheet.ciiva.com/29563/150060ys75000-29563033.pdf?src-supplier=Digi-Key; ComponentLink6URL: https://datasheet.ciiva.com/48430/150060ys75000-eng-tds-48430044.pdf?src-supplier=Distrelec; ComponentLink6Description: https://datasheet.ciiva.com/48430/150060ys75000-eng-tds-48430044.pdf?src-supplier=Distrelec
FB3 = Ferrite Bead: Manufacturer 1: Murata; Manufacturer Part Number 1: BLM15PD121SN1D; Material: Steel,Ferrite; Tolerance: 25%; Number of Circuits: 1; DC Resistance (DCR): 90mR; Max DC Current: 1.3A; Test Frequency: 100MHz; Supplier 1: Digi-Key; Supplier Part Number 1: 490-5203-1-ND; Stock 1: 239261; Pricing 1: 1=0,12000, 10=0,09600, 25=0,08680, 50=0,06360, 100=0,05490, 250=0,04332, 500=0,03658, 1000=0,03080, 5000=0,02743 (USD); RoHS: Yes; Case/Package: 0402; Number of Pins: 2; Core Material: Ferrite; Case Code (Metric): 1005; Case Code (Imperial): 0402; Min Operating Temperature: -55°C; Max Operating Temperature: 125°C; Package Quantity: 1; Packaging: Tape and Reel; Number of Lines: 1; Termination: SMD/SMT; DC Current: 1.3A; Military Standard: Not; Current Rating: 1.3A; Max Current Rating: 1.3A; Length: 1mm; Height: 0.5mm; Width: 0.5mm; Depth: 0.55mm; Radiation Hardening: No; Lead Free: Lead Free; REACH SVHC: No SVHC; ComponentLink1URL: https://datasheet.ciiva.com/18093/getdatasheetpartid-195858-18093157.pdf?src-supplier=Verical; ComponentLink1Description: https://datasheet.ciiva.com/18093/getdatasheetpartid-195858-18093157.pdf?src-supplier=Verical; ComponentLink2URL: https://datasheet.ciiva.com/11800/0900766b811b5866-11800860.pdf?src-supplier=RSComponents; ComponentLink2Description: https://datasheet.ciiva.com/11800/0900766b811b5866-11800860.pdf?src-supplier=RSComponents; ComponentLink3URL: https://datasheet.ciiva.com/41425/001171686-da-01-en-chip-drossel0402-120r-1300ma-1-0x0-5mm-41425776.pdf?src-supplier=Conrad; ComponentLink3Description: https://datasheet.ciiva.com/41425/001171686-da-01-en-chip-drossel0402-120r-1300ma-1-0x0-5mm-41425776.pdf?src-supplier=Conrad; ComponentLink4URL: https://datasheet.ciiva.com/41449/001172205-da-01-en-drossel-0402-120r-11-0x0-5mm-10000st-41449495.pdf?src-supplier=Conrad; ComponentLink4Description: https://datasheet.ciiva.com/41449/001172205-da-01-en-drossel-0402-120r-11-0x0-5mm-10000st-41449495.pdf?src-supplier=Conrad; ComponentLink5URL: https://datasheet.ciiva.com/1012/l0110e-1012434.pdf?src-supplier=Digi-Key; ComponentLink5Description: https://datasheet.ciiva.com/1012/l0110e-1012434.pdf?src-supplier=Digi-Key; ComponentLink6URL: https://datasheet.ciiva.com/1012/l0110e-1012435.pdf?src-supplier=Digi-Key; ComponentLink6Description: https://datasheet.ciiva.com/1012/l0110e-1012435.pdf?src-supplier=Digi-Key; ComponentLink7URL: https://datasheet.ciiva.com/1012/l0110e-1012436.pdf?src-supplier=Digi-Key; ComponentLink7Description: https://datasheet.ciiva.com/1012/l0110e-1012436.pdf?src-supplier=Digi-Key
R52 R54 R55 R60 = Resistor: Manufacturer 1: Panasonic; Manufacturer Part Number 1: ERJ-2RKF1002X; Power Rating: 100mW; Tolerance: 1%; Voltage Rating: 50V; Temperature Coefficient: 100ppm/°C; Supplier 1: Digi-Key; Supplier Part Number 1: P10.0KLDKR-ND; Stock 1: 3290329; Pricing 1: 1=0,10000, 10=0,04100, 100=0,01680, 1000=0,00753, 2500=0,00653, 5000=0,00540 (USD); RoHS: Yes; Mount: Surface Mount; Case/Package: 0402; Number of Pins: 2; Contact Plating: Tin; Case Code (Metric): 1005; Case Code (Imperial): 0402; Min Operating Temperature: -55°C; Max Operating Temperature: 155°C; Packaging: Tape and Reel; Package Quantity: 1; Voltage Rating (DC): 50V; Features: Automotive AEC-Q200; Max Power Dissipation: 100mW; Composition: Thick Film; Number of Terminations: 2; Termination: SMD/SMT; Military Standard: Not; Length: 1mm; Height: 0.35mm; Width: 0.02inch; Depth: 0.5mm; Radiation Hardening: No; Lead Free: Lead Free; REACH SVHC: No SVHC; ComponentLink1URL: https://datasheet.ciiva.com/11821/0900766b80f80784-11821171.pdf?src-supplier=RSComponents; ComponentLink1Description: https://datasheet.ciiva.com/11821/0900766b80f80784-11821171.pdf?src-supplier=RSComponents; ComponentLink2URL: https://datasheet.ciiva.com/16199/aoa0000ce2-16199478.pdf?src-supplier=Future+Electronics; ComponentLink2Description: https://datasheet.ciiva.com/16199/aoa0000ce2-16199478.pdf?src-supplier=Future+Electronics; ComponentLink3URL: https://datasheet.ciiva.com/17212/aoa0000ce2-17212102.pdf?src-supplier=Avnet+Europe; ComponentLink3Description: https://datasheet.ciiva.com/17212/aoa0000ce2-17212102.pdf?src-supplier=Avnet+Europe; ComponentLink4URL: https://datasheet.ciiva.com/24023/aoa0000ce2-24023017.pdf?src-supplier=Mouser; ComponentLink4Description: https://datasheet.ciiva.com/24023/aoa0000ce2-24023017.pdf?src-supplier=Mouser; ComponentLink5URL: https://datasheet.ciiva.com/28514/1678782-28514185.pdf?src-supplier=Element14; ComponentLink5Description: https://datasheet.ciiva.com/28514/1678782-28514185.pdf?src-supplier=Element14; ComponentLink6URL: https://datasheet.ciiva.com/43467/1678782-43467402.pdf?src-supplier=Farnell; ComponentLink6Description: https://datasheet.ciiva.com/43467/1678782-43467402.pdf?src-supplier=Farnell; ComponentLink7URL: https://datasheet.ciiva.com/27055/1987020-27055643.pdf?src-supplier=Jameco; ComponentLink7Description: https://datasheet.ciiva.com/27055/1987020-27055643.pdf?src-supplier=Jameco; ComponentLink8URL: https://datasheet.ciiva.com/48531/aoa0000ce2-48531069.pdf?src-supplier=Avnet; ComponentLink8Description: https://datasheet.ciiva.com/48531/aoa0000ce2-48531069.pdf?src-supplier=Avnet; ComponentLink9URL: https://datasheet.ciiva.com/9194/aoa0000ce2-9194142.pdf?src-supplier=Avnet; ComponentLink9Description: https://datasheet.ciiva.com/9194/aoa0000ce2-9194142.pdf?src-supplier=Avnet; ComponentLink10URL: https://datasheet.ciiva.com/16782/70260748-16782590.pdf?src-supplier=Allied+Electronics; ComponentLink10Description: https://datasheet.ciiva.com/16782/70260748-16782590.pdf?src-supplier=Allied+Electronics; ComponentLink11URL: https://datasheet.ciiva.com/16786/70260748-16786734.pdf?src-supplier=Allied+Electronics; ComponentLink11Description: https://datasheet.ciiva.com/16786/70260748-16786734.pdf?src-supplier=Allied+Electronics; ComponentLink12URL: https://datasheet.ciiva.com/30201/aoa0000ce2-30201022.pdf?src-supplier=Onlinecomponents.com; ComponentLink12Description: https://datasheet.ciiva.com/30201/aoa0000ce2-30201022.pdf?src-supplier=Onlinecomponents.com
R53 R56 = Resistor: Manufacturer 1: Panasonic; Manufacturer Part Number 1: ERJ-2GEJ102X; Temperature Coefficient: 200ppm/°C; Voltage Rating (DC): 50V; Tolerance: 5%; Power Rating: 100mW; Supplier 1: Digi-Key; Supplier Part Number 1: P1.0KJCT-ND; Stock 1: 3554258; Pricing 1: 1=0,10000, 10=0,03200, 100=0,01290, 1000=0,00578, 2500=0,00502, 5000=0,00414 (USD); RoHS: Yes; Mount: Surface Mount; Case/Package: 0402; Case Code (Metric): 1005; Case Code (Imperial): 0402; Contact Plating: Tin; Min Operating Temperature: -55°C; Max Operating Temperature: 155°C; Composition: Thick Film; Number of Terminations: 2; Termination: SMD/SMT; Military Standard: Not; Packaging: Tape and Reel; Voltage Rating: 50V; Package Quantity: 1; Features: Automotive AEC-Q200; Max Power Dissipation: 100mW; Working Voltage: 50V; Length: 1mm; Height: 0.35mm; Depth: 0.5mm; Width: 0.02inch; Radiation Hardening: No; Lead Free: Lead Free; REACH SVHC: No SVHC; ComponentLink1URL: https://datasheet.ciiva.com/11821/0900766b80f806dd-11821202.pdf?src-supplier=RSComponents; ComponentLink1Description: https://datasheet.ciiva.com/11821/0900766b80f806dd-11821202.pdf?src-supplier=RSComponents; ComponentLink2URL: https://datasheet.ciiva.com/34303/1986781-34303542.pdf?src-supplier=Jameco; ComponentLink2Description: https://datasheet.ciiva.com/34303/1986781-34303542.pdf?src-supplier=Jameco; ComponentLink3URL: https://datasheet.ciiva.com/16762/70260739-16762170.pdf?src-supplier=Allied+Electronics; ComponentLink3Description: https://datasheet.ciiva.com/16762/70260739-16762170.pdf?src-supplier=Allied+Electronics; ComponentLink4URL: https://datasheet.ciiva.com/17215/aoa0000ce1-17215306.pdf?src-supplier=Avnet+Europe; ComponentLink4Description: https://datasheet.ciiva.com/17215/aoa0000ce1-17215306.pdf?src-supplier=Avnet+Europe; ComponentLink5URL: https://datasheet.ciiva.com/43460/1500035-43460379.pdf?src-supplier=Farnell; ComponentLink5Description: https://datasheet.ciiva.com/43460/1500035-43460379.pdf?src-supplier=Farnell; ComponentLink6URL: https://datasheet.ciiva.com/16199/aoa0000ce1-16199541.pdf?src-supplier=Future+Electronics; ComponentLink6Description: https://datasheet.ciiva.com/16199/aoa0000ce1-16199541.pdf?src-supplier=Future+Electronics; ComponentLink7URL: https://datasheet.ciiva.com/30219/4aoa0000ce1-30219159.pdf?src-supplier=Onlinecomponents.com; ComponentLink7Description: https://datasheet.ciiva.com/30219/4aoa0000ce1-30219159.pdf?src-supplier=Onlinecomponents.com; ComponentLink8URL: https://datasheet.ciiva.com/22783/1500035-22783817.pdf?src-supplier=Farnell; ComponentLink8Description: https://datasheet.ciiva.com/22783/1500035-22783817.pdf?src-supplier=Farnell; ComponentLink9URL: https://datasheet.ciiva.com/48531/aoa0000ce1-48531081.pdf?src-supplier=Avnet; ComponentLink9Description: https://datasheet.ciiva.com/48531/aoa0000ce1-48531081.pdf?src-supplier=Avnet; ComponentLink10URL: https://datasheet.ciiva.com/46386/1500035-46386458.pdf?src-supplier=Element14; ComponentLink10Description: https://datasheet.ciiva.com/46386/1500035-46386458.pdf?src-supplier=Element14; ComponentLink11URL: https://datasheet.ciiva.com/16511/aoa0000ce1-16511421.pdf?src-supplier=Avnet+Asia; ComponentLink11Description: https://datasheet.ciiva.com/16511/aoa0000ce1-16511421.pdf?src-supplier=Avnet+Asia; ComponentLink12URL: https://datasheet.ciiva.com/46371/1500035-46371935.pdf?src-supplier=Element14; ComponentLink12Description: https://datasheet.ciiva.com/46371/1500035-46371935.pdf?src-supplier=Element14
R57 = Resistor: Manufacturer 1: Panasonic; Manufacturer Part Number 1: ERA-2AEB1242X; Max Power Dissipation: 63mW; Temperature Coefficient: 25ppm/°C; Voltage Rating (DC): 50V; Tolerance: 0.1%; Voltage Rating: 25V; Supplier 1: Digi-Key; Supplier Part Number 1: P12.4KDCCT-ND; Stock 1: 80014; Pricing 1: 1=0,45000, 10=0,32100, 100=0,12830, 1000=0,06322, 2500=0,05858, 5000=0,05300 (USD); RoHS: Yes; Mount: Surface Mount; Case/Package: 0402; Case Code (Metric): 1005; Case Code (Imperial): 0402; Contact Plating: Tin; Min Operating Temperature: -55°C; Max Operating Temperature: 155°C; Composition: Metal Film,Thin Film; Number of Terminations: 2; Military Standard: Not; Packaging: Tape and Reel; Power Rating: 63mW; Package Quantity: 1; Features: Automotive AEC-Q200; Termination: SMD/SMT; Length: 1mm; Height: 0.016inch; Depth: 0.5mm; Width: 0.5mm; REACH SVHC: Unknown; Lead Free: Lead Free; ComponentLink1URL: https://datasheet.ciiva.com/24067/aoa0000ce26-32660-24067607.pdf?src-supplier=Mouser; ComponentLink1Description: https://datasheet.ciiva.com/24067/aoa0000ce26-32660-24067607.pdf?src-supplier=Mouser; ComponentLink2URL: https://datasheet.ciiva.com/48531/aoa0000ce26-48531851.pdf?src-supplier=Avnet; ComponentLink2Description: https://datasheet.ciiva.com/48531/aoa0000ce26-48531851.pdf?src-supplier=Avnet
R58 = Resistor: Manufacturer 1: Yageo; Manufacturer Part Number 1: RC0402FR-071ML; Tolerance: 1%; Power Rating: 63mW; Voltage Rating: 50V; Temperature Coefficient: 100ppm/°C; Supplier 1: Digi-Key; Supplier Part Number 1: 311-1.00MLRDKR-ND; Stock 1: 1751750; Pricing 1: 1=0,10000, 10=0,01600, 100=0,00640, 1000=0,00289, 2500=0,00251, 5000=0,00207 (USD); RoHS: Yes; Case/Package: 0402; Case Code (Imperial): 0402; Case Code (Metric): 1005; Min Operating Temperature: -55°C; Max Operating Temperature: 155°C; Packaging: Tape and Reel; Termination: SMD/SMT; Composition: Thick Film; Military Standard: Not; Length: 1mm; Height: 0.32mm; Depth: 0.5mm; Lead Free: Lead Free; REACH SVHC: Unknown; ComponentLink1URL: https://datasheet.ciiva.com/11808/0900766b80c66297-11808125.pdf?src-supplier=RSComponents; ComponentLink1Description: https://datasheet.ciiva.com/11808/0900766b80c66297-11808125.pdf?src-supplier=RSComponents; ComponentLink2URL: https://datasheet.ciiva.com/46394/1018594-46394951.pdf?src-supplier=Element14; ComponentLink2Description: https://datasheet.ciiva.com/46394/1018594-46394951.pdf?src-supplier=Element14; ComponentLink3URL: https://datasheet.ciiva.com/16741/pyu-rc0402-51-rohs-l-6-r-16741081.pdf?src-supplier=Future+Electronics; ComponentLink3Description: https://datasheet.ciiva.com/16741/pyu-rc0402-51-rohs-l-6-r-16741081.pdf?src-supplier=Future+Electronics; ComponentLink4URL: https://datasheet.ciiva.com/7849/1018594-7849882.pdf?src-supplier=Element14; ComponentLink4Description: https://datasheet.ciiva.com/7849/1018594-7849882.pdf?src-supplier=Element14; ComponentLink5URL: https://datasheet.ciiva.com/7849/1018594-7849883.pdf?src-supplier=Element14; ComponentLink5Description: https://datasheet.ciiva.com/7849/1018594-7849883.pdf?src-supplier=Element14
R61-R63 R66 = Resistor: Manufacturer: Yageo; Manufacturer Part Number: RC0402FR-0749R9L; Tolerance: 1%; Voltage Rating (DC): 50V; Power Rating: 62.5mW; Temperature Coefficient: 100ppm/°C; Max Power Dissipation: 63mW; Supplier 1: Digi-Key; Supplier Part Number 1: 311-49.9LRCT-ND; Stock 1: 20089105; Case/Package: 0402; Number of Pins: 2; Case Code (Imperial): 0402; Case Code (Metric): 1005; Min Operating Temperature: -55°C; Max Operating Temperature: 155°C; Packaging: Tape and Reel; Package Quantity: 1; Features: Moisture Resistant; Voltage Rating: 50V; Termination: SMD/SMT; Composition: Thick Film; Number of Terminations: 2; Military Standard: Not; Working Voltage: 50V; Length: 1mm; Height: 0.016inch; Width: 0.5mm; Depth: 0.5mm; Lead Free: Lead Free; REACH SVHC: No SVHC; ComponentLink1URL: http://documents.rs-components.com/techlib://itc_doclist_GB.htm?stockno=6184536&src-supplier=RSComponents; ComponentLink1Description: http://documents.rs-components.com/techlib://itc_doclist_GB.htm?stockno=6184536&src-supplier=RSComponents; ComponentLink2URL: http://www.farnell.com/datasheets/2167052.pdf?src-supplier=Element14; ComponentLink2Description: http://www.farnell.com/datasheets/2167052.pdf?src-supplier=Element14; ComponentLink3URL: http://www.yageo.com/documents/recent/PYu-RC0402_51_RoHS_L_6_r.pdf?src-supplier=Future+Electronics; ComponentLink3Description: http://www.yageo.com/documents/recent/PYu-RC0402_51_RoHS_L_6_r.pdf?src-supplier=Future+Electronics; ComponentLink4URL: http://www.yageo.com/documents/recent/PYu-RC_Group_51_RoHS_L_10.pdf?src-supplier=Digi-Key; ComponentLink4Description: http://www.yageo.com/documents/recent/PYu-RC_Group_51_RoHS_L_10.pdf?src-supplier=Digi-Key
U13 = W5500_LQFP48: Ethernet to SPI MCU converter. Onboard TCP handling; Manufacturer 1: WIZnet; Operating Supply Current: 132mA; Number of Transceivers: 1; Max Supply Voltage: 3.63V; Min Supply Voltage: 2.97V; Supplier 1: Digi-Key; Stock 1: 8927; Pricing 1: 1=3,95000, 10=3,54600, 25=3,35240, 100=2,75650, 250=2,47340, 500=2,38400, 1000=1,98170, 2500=1,90720, 5000=1,84760 (USD); RoHS: Yes; Case/Package: LQFP; Number of Pins: 48; Min Operating Temperature: -40°C; Max Operating Temperature: 85°C; Package Quantity: 250; Max Supply Current: 132mA; Packaging: Tray; Interface: SPI; Lead Free: Lead Free; ComponentLink1URL: https://datasheet.ciiva.com/29644/w5500-ds-v100e-29644866.pdf?src-supplier=Digi-Key; ComponentLink1Description: https://datasheet.ciiva.com/29644/w5500-ds-v100e-29644866.pdf?src-supplier=Digi-Key; ComponentLink2URL: https://datasheet.ciiva.com/24199/w5500-24199988.pdf?src-supplier=Future+Electronics; ComponentLink2Description: https://datasheet.ciiva.com/24199/w5500-24199988.pdf?src-supplier=Future+Electronics; Supplier Part Number 1: 1278-1021-ND
Y3 = Crystal_4Pin_ABM8G: Manufacturer 1: Abracon; Manufacturer Part Number 1: ABM8G-25.000MHZ-B4Y-T; Frequency Tolerance: 30ppm; Load Capacitance: 10pF; ESR (Equivalent Series Resistance): 60R; Supplier 1: Digi-Key; Stock 1: 30143; Pricing 1: 1=0,94000, 10=0,83500, 50=0,78040, 100=0,68970, 500=0,65340 (USD); RoHS: Yes; Mount: Surface Mount; Case/Package: SMD/SMT; Number of Pins: 4; Min Operating Temperature: -20°C; Max Operating Temperature: 70°C; Packaging: Tape and Reel; Package Quantity: 1000; Tolerance: 30ppm; Frequency Stability: 30ppm; Termination: SMD/SMT; Series Resistance: 60R; Length: 3.2mm; Height: 0.039inch; Width: 0.098inch; Depth: 2.5mm; REACH SVHC: Unknown; Lead Free: Lead Free; ComponentLink1URL: https://datasheet.ciiva.com/16416/abm8g-16416874.pdf?src-supplier=Future+Electronics; ComponentLink1Description: https://datasheet.ciiva.com/16416/abm8g-16416874.pdf?src-supplier=Future+Electronics; ComponentLink2URL: https://datasheet.ciiva.com/28508/1883677-28508586.pdf?src-supplier=Element14; ComponentLink2Description: https://datasheet.ciiva.com/28508/1883677-28508586.pdf?src-supplier=Element14; ComponentLink3URL: https://datasheet.ciiva.com/7998/abm8g-7998635.pdf?src-supplier=Element14; ComponentLink3Description: https://datasheet.ciiva.com/7998/abm8g-7998635.pdf?src-supplier=Element14; ComponentLink4URL: https://datasheet.ciiva.com/855/abm8g-855228.pdf?src-supplier=Digi-Key; ComponentLink4Description: https://datasheet.ciiva.com/855/abm8g-855228.pdf?src-supplier=Digi-Key; ComponentLink5URL: https://datasheet.ciiva.com/855/abm8g-855229.pdf?src-supplier=Digi-Key; ComponentLink5Description: https://datasheet.ciiva.com/855/abm8g-855229.pdf?src-supplier=Digi-Key; ComponentLink6URL: https://datasheet.ciiva.com/855/abm8g-855230.pdf?src-supplier=Digi-Key; ComponentLink6Description: https://datasheet.ciiva.com/855/abm8g-855230.pdf?src-supplier=Digi-Key; ComponentLink7URL: https://datasheet.ciiva.com/4945/abm8g-10572-4945134.pdf?src-supplier=Mouser; ComponentLink7Description: https://datasheet.ciiva.com/4945/abm8g-10572-4945134.pdf?src-supplier=Mouser; Supplier Part Number: 535-10297-1-ND